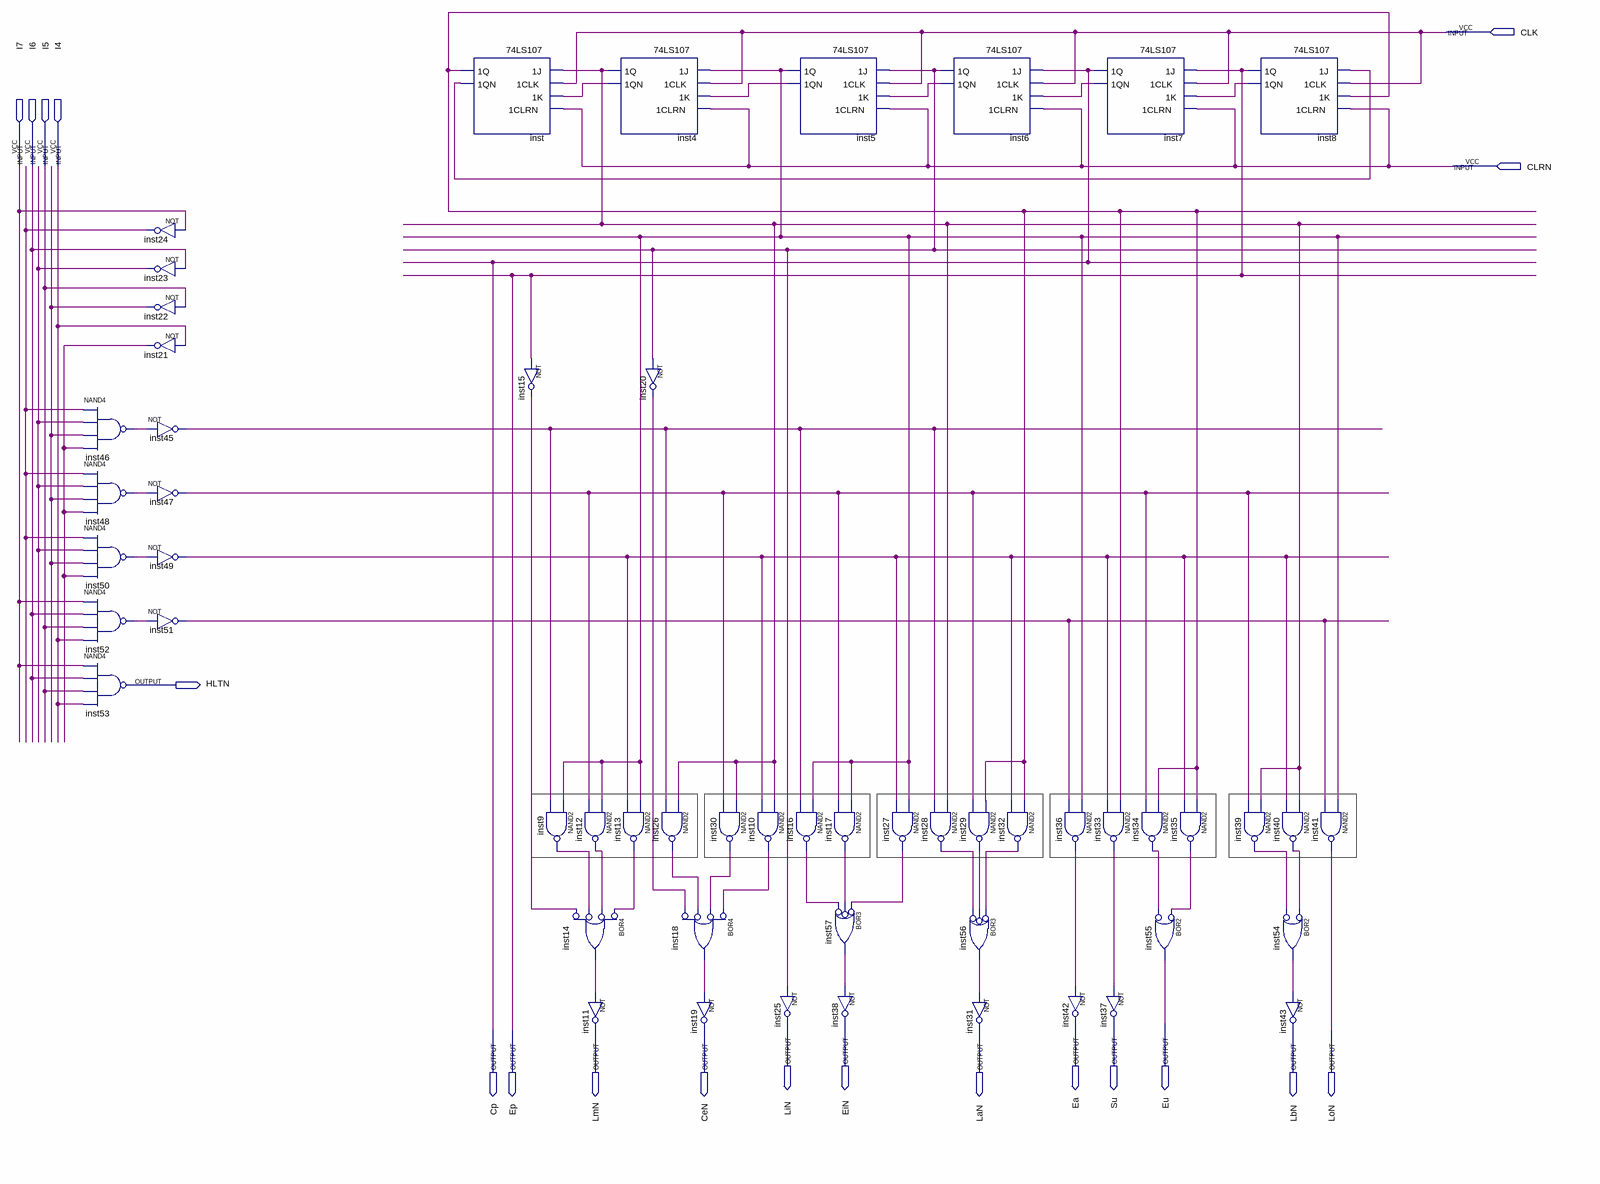
[diagram p0: schematic sheet]
// Quartus schematic Decodificador de instrucoes, contador em anel e matriz de controle.bdf as structural Verilog: 54 symbols, 19 pins
module \Decodificador_de_instrucoes,_contador_em_anel_e_matriz_de_controle  (
  input  CLK,
  input  I7,
  input  I6,
  input  I5,
  input  I4,
  input  CLRN,
  output HLTN,
  output LiN,
  output EiN,
  output Ea,
  output Su,
  output Eu,
  output Cp,
  output Ep,
  output LmN,
  output CeN,
  output LaN,
  output LbN,
  output LoN
);

  wire inst4_1q, inst4_1qn, inst5_1q, inst5_1qn, inst6_1q, inst6_1qn, inst7_1qn, inst8_1qn, inst9_out,
       inst10_out, inst12_out, inst13_out, inst14_out, inst15_out, inst16_out, inst17_out, inst18_out,
       inst20_out, inst21_out, inst22_out, inst23_out, inst24_out, inst26_out, inst27_out, inst28_out,
       inst29_out, inst30_out, inst32_out, inst33_out, inst34_out, inst35_out, inst36_out, inst39_out,
       inst40_out, inst45_out, inst46_out, inst47_out, inst48_out, inst49_out, inst50_out, inst51_out,
       inst52_out, inst54_out, inst56_out, inst57_out, inst_1q, inst_1qn;

  nand inst46 (inst46_out, inst24_out, inst23_out, inst22_out, inst21_out);
  nand inst48 (inst48_out, inst24_out, inst23_out, inst22_out, inst21_out);
  nand inst50 (inst50_out, inst24_out, inst23_out, inst22_out, inst21_out);
  nand inst52 (inst52_out, I7, I6, I5, I4);
  nand inst53 (HLTN, I7, I6, I5, I4);
  not inst24 (inst24_out, I7);
  not inst23 (inst23_out, I6);
  not inst22 (inst22_out, I5);
  not inst21 (inst21_out, I4);
  not inst45 (inst45_out, inst46_out);
  not inst47 (inst47_out, inst48_out);
  not inst49 (inst49_out, inst50_out);
  not inst51 (inst51_out, inst52_out);
  \74LS107  inst (.\1J (inst4_1q), .\1CLK (CLK), .\1K (inst4_1qn), .\1CLRN (CLRN), .\1Q (inst_1q), .\1QN (inst_1qn));
  not inst15 (inst15_out, Ep);
  nand inst9 (inst9_out, inst5_1q, inst45_out);
  nand inst12 (inst12_out, inst5_1q, inst47_out);
  or inst14 (inst14_out, ~inst13_out, ~inst12_out, ~inst9_out, ~inst15_out);  // BOR4
  \74LS107  inst4 (.\1J (inst5_1q), .\1CLK (CLK), .\1K (inst5_1qn), .\1CLRN (CLRN), .\1Q (inst4_1q), .\1QN (inst4_1qn));
  nand inst13 (inst13_out, inst5_1q, inst49_out);
  not inst11 (LmN, inst14_out);
  not inst20 (inst20_out, inst6_1q);
  nand inst26 (inst26_out, inst4_1q, inst45_out);
  or inst18 (inst18_out, ~inst10_out, ~inst30_out, ~inst26_out, ~inst20_out);  // BOR4
  nand inst30 (inst30_out, inst4_1q, inst47_out);
  not inst19 (CeN, inst18_out);
  nand inst10 (inst10_out, inst4_1q, inst49_out);
  not inst25 (LiN, inst6_1q);
  \74LS107  inst5 (.\1J (inst6_1q), .\1CLK (CLK), .\1K (inst6_1qn), .\1CLRN (CLRN), .\1Q (inst5_1q), .\1QN (inst5_1qn));
  nand inst16 (inst16_out, inst5_1q, inst45_out);
  nand inst17 (inst17_out, inst5_1q, inst47_out);
  or inst57 (inst57_out, ~inst27_out, ~inst17_out, ~inst16_out);  // BOR3
  not inst38 (EiN, inst57_out);
  nand inst27 (inst27_out, inst5_1q, inst49_out);
  nand inst28 (inst28_out, inst4_1q, inst45_out);
  \74LS107  inst6 (.\1J (Cp), .\1CLK (CLK), .\1K (inst7_1qn), .\1CLRN (CLRN), .\1Q (inst6_1q), .\1QN (inst6_1qn));
  nand inst29 (inst29_out, inst_1q, inst47_out);
  or inst56 (inst56_out, ~inst32_out, ~inst29_out, ~inst28_out);  // BOR3
  not inst31 (LaN, inst56_out);
  nand inst32 (inst32_out, inst_1q, inst49_out);
  nand inst36 (inst36_out, inst5_1q, inst51_out);
  not inst42 (Ea, inst36_out);
  \74LS107  inst7 (.\1J (Ep), .\1CLK (CLK), .\1K (inst8_1qn), .\1CLRN (CLRN), .\1Q (Cp), .\1QN (inst7_1qn));
  nand inst33 (inst33_out, inst_1q, inst49_out);
  nand inst34 (inst34_out, inst_1q, inst47_out);
  not inst37 (Su, inst33_out);
  nand inst35 (inst35_out, inst_1q, inst49_out);
  or inst55 (Eu, ~inst35_out, ~inst34_out);  // BOR2
  nand inst39 (inst39_out, inst4_1q, inst47_out);
  \74LS107  inst8 (.\1J (inst_1qn), .\1CLK (CLK), .\1K (inst_1q), .\1CLRN (CLRN), .\1Q (Ep), .\1QN (inst8_1qn));
  nand inst40 (inst40_out, inst4_1q, inst49_out);
  or inst54 (inst54_out, ~inst40_out, ~inst39_out);  // BOR2
  not inst43 (LbN, inst54_out);
  nand inst41 (LoN, inst5_1q, inst51_out);
endmodule
